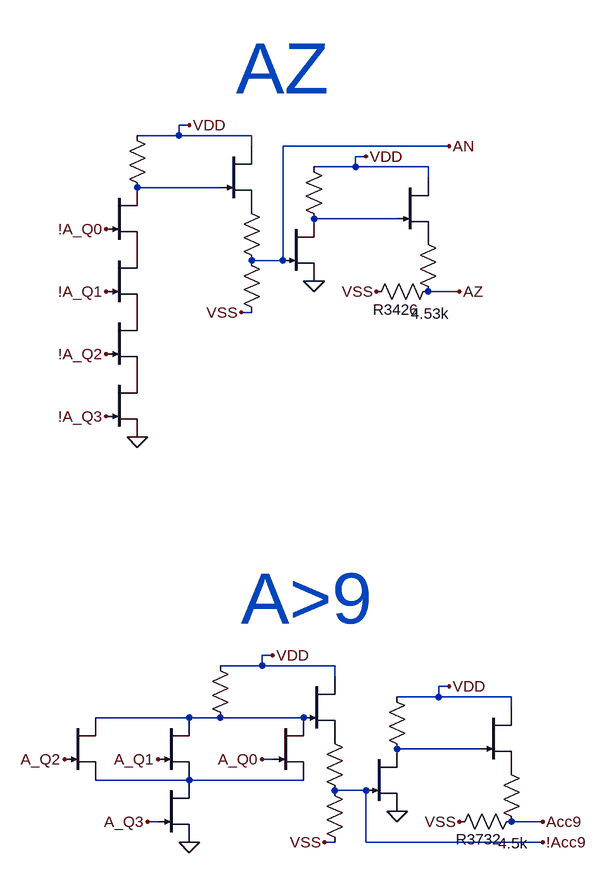
[diagram p0: schematic Detect if Acc is zero or 9.asc]
Detect if Acc is zero or 9.asc, the LTspice schematic file:
Version 4.1
SHEET 1 109444 42780
WIRE -6656 -272 -6672 -272
WIRE -6672 -256 -6672 -272
WIRE -6672 -256 -6736 -256
WIRE -6560 -256 -6672 -256
WIRE -6560 -240 -6560 -256
WIRE -6256 -240 -6512 -240
WIRE -6384 -224 -6400 -224
WIRE -6400 -208 -6400 -224
WIRE -6400 -208 -6464 -208
WIRE -6288 -208 -6400 -208
WIRE -6288 -192 -6288 -208
WIRE -6608 -176 -6736 -176
WIRE -6336 -128 -6464 -128
WIRE -6512 -64 -6512 -240
WIRE -6512 -64 -6560 -64
WIRE -6240 -16 -6288 -16
WIRE -6560 16 -6576 16
WIRE -6528 544 -6544 544
WIRE -6544 560 -6544 544
WIRE -6544 560 -6608 560
WIRE -6432 560 -6544 560
WIRE -6432 576 -6432 560
WIRE -6256 592 -6272 592
WIRE -6272 608 -6272 592
WIRE -6272 608 -6336 608
WIRE -6160 608 -6272 608
WIRE -6160 624 -6160 608
WIRE -6656 640 -6800 640
WIRE -6608 640 -6656 640
WIRE -6480 640 -6608 640
WIRE -6208 688 -6336 688
WIRE -6528 704 -6544 704
WIRE -6656 736 -6800 736
WIRE -6480 736 -6656 736
WIRE -6384 752 -6432 752
WIRE -6704 800 -6720 800
WIRE -6112 800 -6160 800
WIRE -6432 832 -6448 832
WIRE -6384 832 -6384 752
WIRE -6112 832 -6384 832
FLAG -6464 -32 0
FLAG -6656 -272 VDD
FLAG -6384 -224 VDD
FLAG -6576 16 VSS
FLAG -6368 -16 VSS
FLAG -6736 208 0
FLAG -6784 -112 !A_Q0
FLAG -6784 80 !A_Q2
FLAG -6784 176 !A_Q3
FLAG -6544 704 A_Q0
FLAG -6336 784 0
FLAG -6528 544 VDD
FLAG -6256 592 VDD
FLAG -6448 832 VSS
FLAG -6240 800 VSS
FLAG -6704 704 A_Q1
FLAG -6720 800 A_Q3
FLAG -6848 704 A_Q2
FLAG -6656 832 0
FLAG -6112 800 Acc9
FLAG -6112 832 !Acc9
FLAG -6784 -16 !A_Q1
FLAG -6256 -240 AN
FLAG -6240 -16 AZ
SYMBOL njf -6784 -176 R0
WINDOW 0 56 32 Invisible 2
WINDOW 3 56 72 Invisible 2
SYMATTR InstName J_A2103
SYMATTR Value DR
SYMBOL res -6752 -272 R0
WINDOW 0 56 32 Invisible 2
WINDOW 3 56 72 Invisible 2
SYMATTR InstName R3421
SYMATTR Value 100k
SYMBOL njf -6608 -240 R0
WINDOW 0 56 32 Invisible 2
WINDOW 3 56 72 Invisible 2
SYMATTR InstName J_F874
SYMATTR Value DR
SYMBOL res -6576 -160 R0
WINDOW 0 38 53 Invisible 2
WINDOW 3 -35 51 Invisible 2
SYMATTR InstName R3422
SYMATTR Value 1k
SYMBOL res -6576 -80 R0
WINDOW 0 41 61 Invisible 2
WINDOW 3 -53 52 Invisible 2
SYMATTR InstName R3423
SYMATTR Value 4.8k
SYMBOL njf -6784 -80 R0
WINDOW 0 56 32 Invisible 2
WINDOW 3 56 72 Invisible 2
SYMATTR InstName J_B993
SYMATTR Value DR
SYMBOL njf -6512 -128 R0
WINDOW 0 56 32 Invisible 2
WINDOW 3 56 72 Invisible 2
SYMATTR InstName J_A2104
SYMATTR Value DR
SYMBOL res -6480 -224 R0
WINDOW 0 56 32 Invisible 2
WINDOW 3 56 72 Invisible 2
SYMATTR InstName R3424
SYMATTR Value 50k
SYMBOL njf -6336 -192 R0
WINDOW 0 56 32 Invisible 2
WINDOW 3 56 72 Invisible 2
SYMATTR InstName J_F875
SYMATTR Value DR
SYMBOL res -6304 -112 R0
WINDOW 0 37 24 Invisible 2
WINDOW 3 -30 25 Invisible 2
SYMATTR InstName R3425
SYMATTR Value 1k
SYMBOL res -6272 -32 R90
WINDOW 0 59 66 VBottom 2
WINDOW 3 34 13 VTop 2
SYMATTR InstName R3426
SYMATTR Value 4.53k
SYMBOL njf -6784 16 R0
WINDOW 0 56 32 Invisible 2
WINDOW 3 56 72 Invisible 2
SYMATTR InstName J_C1
SYMATTR Value DR
SYMBOL njf -6784 112 R0
WINDOW 0 56 32 Invisible 2
WINDOW 3 56 72 Invisible 2
SYMATTR InstName J_D1
SYMATTR Value DR
SYMBOL njf -6528 640 R0
WINDOW 0 56 32 Invisible 2
WINDOW 3 56 72 Invisible 2
SYMATTR InstName J_A2304
SYMATTR Value DR
SYMBOL res -6624 544 R0
WINDOW 0 56 32 Invisible 2
WINDOW 3 56 72 Invisible 2
SYMATTR InstName R3727
SYMATTR Value 100k
SYMBOL njf -6480 576 R0
WINDOW 0 56 32 Invisible 2
WINDOW 3 56 72 Invisible 2
SYMATTR InstName J_F937
SYMATTR Value DR
SYMBOL res -6448 656 R0
WINDOW 0 38 53 Invisible 2
WINDOW 3 -35 51 Invisible 2
SYMATTR InstName R3728
SYMATTR Value 1k
SYMBOL res -6448 736 R0
WINDOW 0 41 61 Invisible 2
WINDOW 3 -53 52 Invisible 2
SYMATTR InstName R3729
SYMATTR Value 4.8k
SYMBOL njf -6704 640 R0
WINDOW 0 56 32 Invisible 2
WINDOW 3 56 72 Invisible 2
SYMATTR InstName J_B1087
SYMATTR Value DR
SYMBOL njf -6384 688 R0
WINDOW 0 56 32 Invisible 2
WINDOW 3 56 72 Invisible 2
SYMATTR InstName J_A2305
SYMATTR Value DR
SYMBOL res -6352 592 R0
WINDOW 0 56 32 Invisible 2
WINDOW 3 56 72 Invisible 2
SYMATTR InstName R3730
SYMATTR Value 50k
SYMBOL njf -6208 624 R0
WINDOW 0 56 32 Invisible 2
WINDOW 3 56 72 Invisible 2
SYMATTR InstName J_F938
SYMATTR Value DR
SYMBOL res -6176 704 R0
WINDOW 0 37 24 Invisible 2
WINDOW 3 -30 25 Invisible 2
SYMATTR InstName R3731
SYMATTR Value 1k
SYMBOL res -6144 784 R90
WINDOW 0 59 66 VBottom 2
WINDOW 3 34 13 VTop 2
SYMATTR InstName R3732
SYMATTR Value 4.5k
SYMBOL njf -6704 736 R0
WINDOW 0 56 32 Invisible 2
WINDOW 3 56 72 Invisible 2
SYMATTR InstName J_A2306
SYMATTR Value DR
SYMBOL njf -6848 640 R0
WINDOW 0 56 32 Invisible 2
WINDOW 3 56 72 Invisible 2
SYMATTR InstName J_B1088
SYMATTR Value DR
TEXT -6584 -360 Left 7 ;AZ
TEXT -6576 456 Left 7 ;A>9

The netlist it stands for:
* Detect if Acc is zero or 9.asc
J_A2103 N001 !A_Q0 P001 DR
R3421 VDD N001 100k
J_F874 VDD N001 P002 DR
R3422 P002 AN 1k
R3423 AN VSS 4.8k
J_B993 P001 !A_Q1 P003 DR
J_A2104 N002 AN 0 DR
R3424 VDD N002 50k
J_F875 VDD N002 P004 DR
R3425 P004 AZ 1k
R3426 AZ VSS 4.53k
J_C1 P003 !A_Q2 P005 DR
J_D1 P005 !A_Q3 0 DR
J_A2304 N003 A_Q0 N005 DR
R3727 VDD N003 100k
J_F937 VDD N003 P006 DR
R3728 P006 !Acc9 1k
R3729 !Acc9 VSS 4.8k
J_B1087 N003 A_Q1 N005 DR
J_A2305 N004 !Acc9 0 DR
R3730 VDD N004 50k
J_F938 VDD N004 P007 DR
R3731 P007 Acc9 1k
R3732 Acc9 VSS 4.5k
J_A2306 N005 A_Q3 0 DR
J_B1088 N003 A_Q2 N005 DR
.model NJF NJF
.model PJF PJF
.lib standard.jft
* AZ
* A>9
.backanno
.end